# Altium project Earendel_Rules_Enabled_V2.PrjPcb
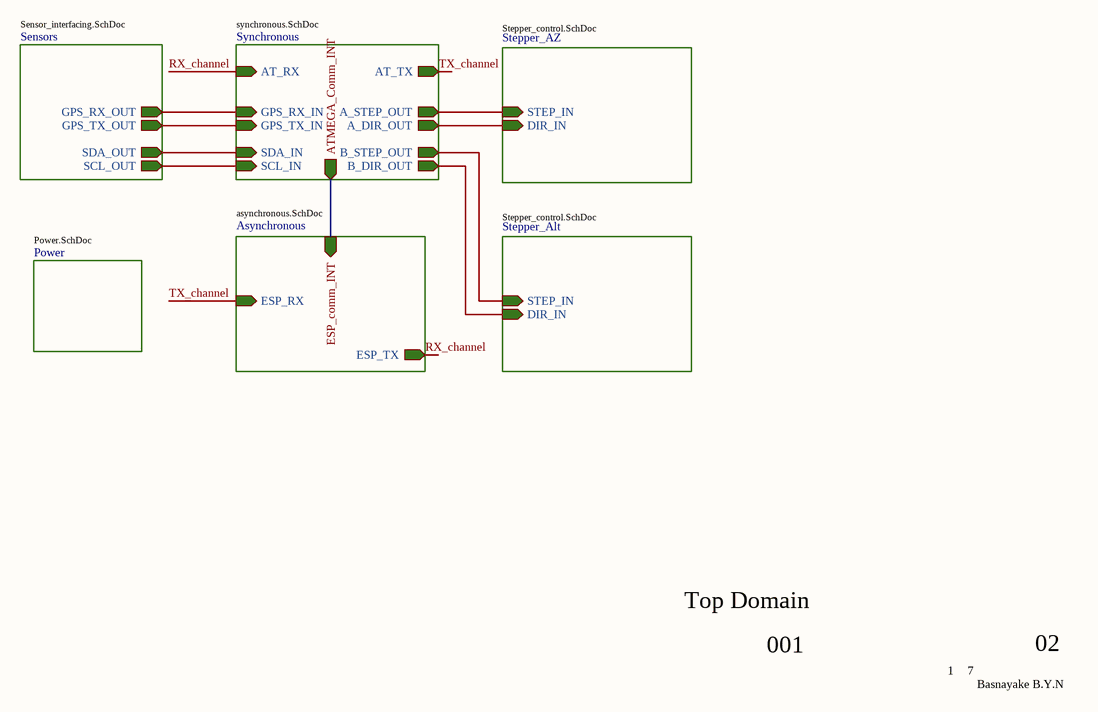
[diagram p0: Top_domain.SchDoc]
6 sheets, 91 parts. Net scope: hierarchical (ports join the sheet entries above them; power ports are global).
Board file: PCBmain.PcbDoc
Sheets:
  Top_domain.SchDoc
    Power = Power.SchDoc
    Synchronous = synchronous.SchDoc
    Asynchronous = asynchronous.SchDoc
    Sensors = Sensor_interfacing.SchDoc
    Stepper_AZ = Stepper_control.SchDoc
    Stepper_Alt = Stepper_control.SchDoc

## Sheet Top_domain.SchDoc
size A4; SheetNumber: 1; SheetTotal: 6

### Sub-sheets
Asynchronous = asynchronous.SchDoc: ESP_RX (in), ESP_TX (out), ESP_comm_INT (in)
Power = Power.SchDoc: no entries
Sensors = Sensor_interfacing.SchDoc: GPS_RX_OUT (out), GPS_TX_OUT (out), SDA_OUT (out), SCL_OUT (out)
Stepper_Alt = Stepper_control.SchDoc: STEP_IN (in), DIR_IN (in)
Stepper_AZ = Stepper_control.SchDoc: STEP_IN (in), DIR_IN (in)
Synchronous = synchronous.SchDoc: AT_TX (out), AT_RX (in), GPS_RX_IN (in), GPS_TX_IN (in), SDA_IN (in), SCL_IN (in), A_STEP_OUT (out), B_STEP_OUT (out), A_DIR_OUT (out), B_DIR_OUT (out), ATMEGA_Comm_INT (out)

### Nets
6P: sheet Synchronous/GPS_RX_IN, sheet Sensors/GPS_RX_OUT
7P: sheet Synchronous/GPS_TX_IN, sheet Sensors/GPS_TX_OUT
45P: sheet Synchronous/B_DIR_OUT, sheet Stepper_Alt/DIR_IN
46P: sheet Synchronous/A_DIR_OUT, sheet Stepper_AZ/DIR_IN
47P: sheet Synchronous/B_STEP_OUT, sheet Stepper_Alt/STEP_IN
48P: sheet Synchronous/A_STEP_OUT, sheet Stepper_AZ/STEP_IN
RX_channel: sheet Synchronous/AT_RX, sheet Asynchronous/ESP_TX  [project net 0P]
SCL: sheet Synchronous/SCL_IN, sheet Sensors/SCL_OUT
SDA: sheet Synchronous/SDA_IN, sheet Sensors/SDA_OUT
TX_channel: sheet Synchronous/AT_TX, sheet Asynchronous/ESP_RX  [project net 1P]
NetU1_4: sheet Synchronous/ATMEGA_Comm_INT, sheet Asynchronous/ESP_comm_INT

### Notes on the sheet
- Top Domain
- 001
- 1
- 7
- 02
- Basnayake B.Y.N

## Sheet Power.SchDoc
size A4; SheetNumber: 4; SheetTotal: 6
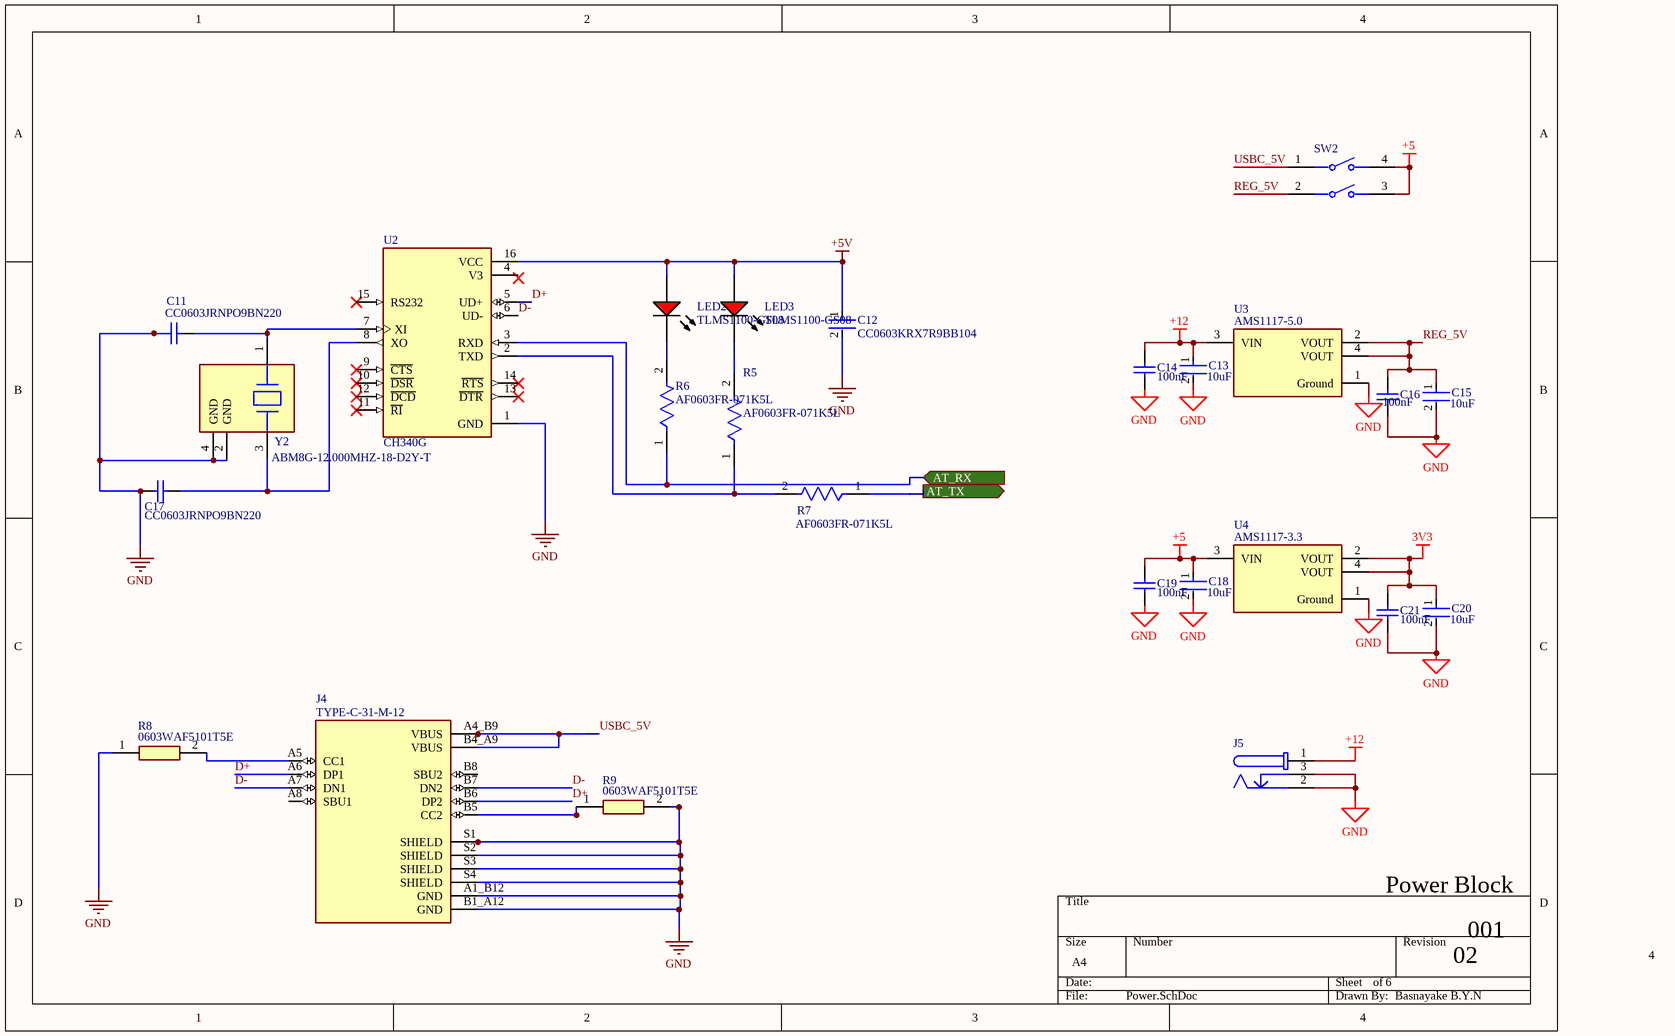
[diagram p1: Power.SchDoc]

### Parts
C11  CC0603JRNPO9BN220  [CAPC1608X90X40LL10T20]
C12  CC0603KRX7R9BB104  [FP-CC0603-DA-MFG]
C13  Capacitance: 10uF  [FP-1206-L_3_2_0_2-W_1_6_0-IPC_B]  (hidden comment: 1206YD106KAT2A)
C14  value 100nF  [CAPC2013X140X50LL20T25]  (hidden comment: 08055F104KAT2A)
C15  Capacitance: 10uF  [FP-1206-L_3_2_0_2-W_1_6_0-IPC_B]  (hidden comment: 1206YD106KAT2A)
C16  value 100nF  [CAPC2013X140X50LL20T25]  (hidden comment: 08055F104KAT2A)
C17  CC0603JRNPO9BN220  [CAPC1608X90X40LL10T20]
C18  Capacitance: 10uF  [FP-1206-L_3_2_0_2-W_1_6_0-IPC_B]  (hidden comment: 1206YD106KAT2A)
C19  value 100nF  [CAPC2013X140X50LL20T25]  (hidden comment: 08055F104KAT2A)
C20  Capacitance: 10uF  [FP-1206-L_3_2_0_2-W_1_6_0-IPC_B]  (hidden comment: 1206YD106KAT2A)
C21  value 100nF  [CAPC2013X140X50LL20T25]  (hidden comment: 08055F104KAT2A)
J4  TYPE-C-31-M-12  [HRO_TYPE-C-31-M-12]
J5  694106301002  [694106301002]  (value not drawn)
LED2  TLMS1100-GS08  [VISH-TLMX1100_V]
LED3  TLMS1100-GS08  [VISH-TLMX1100_V]
R5  AF0603FR-071K5L  [FP-AF0603-IPC_B]
R6  AF0603FR-071K5L  [FP-AF0603-IPC_B]
R7  AF0603FR-071K5L  [FP-AF0603-IPC_B]
R8  0603WAF5101T5E  [RESC1608X55N]
R9  0603WAF5101T5E  [RESC1608X55N]
SW2  A6T-2104  [FP-A6T-2104-MFG]  (value not drawn)
U2  CH340G  [SOIC127P600X180-16N]
U3  AMS1117-5.0  [FP-AMS1117-IPC_C]
U4  AMS1117-3.3  [FP-AMS1117-IPC_C]
Y2  ABM8G-12.000MHZ-18-D2Y-T  [FP-ABM8G-MFG]

### Ports
AT_RX (in), AT_TX (out)

### Nets
3V3: C20.1 C21.2 U4.2(VOUT) U4.4(VOUT)
+5: C18.1 C19.2 SW2.3 SW2.4 U4.3(VIN)
+5V: C12.1 LED2.1(A) LED3.1(A) U2.16(VCC)
+12: C13.1 C14.2 J5.1 U3.3(VIN)
GND: C11.1 C12.2 C13.2 C14.1 C15.2 C16.1 C17.1 C18.2 C19.1 C20.2 C21.1 J4.A1_B12(GND) J4.B1_A12(GND) J4.S1(SHIELD) J4.S2(SHIELD) J4.S3(SHIELD) J4.S4(SHIELD) J5.2 J5.3 R8.1 R9.2 U2.1(GND) U3.1(Ground) U4.1(Ground) Y2.2(GND) Y2.4(GND)
D+: J4.A6(DP1) J4.B6(DP2) U2.5(UD+)
D-: J4.A7(DN1) J4.B7(DN2) U2.6(UD-)
REG_5V: C15.1 C16.2 SW2.2 U3.2(VOUT) U3.4(VOUT)
USBC_5V: J4.A4_B9(VBUS) J4.B4_A9(VBUS) SW2.1
NetC11_2: C11.2 U2.7(XI) Y2.1
NetC17_2: C17.2 U2.8(XO) Y2.3
NetJ4_A5: J4.A5(CC1) R8.2
NetJ4_B5: J4.B5(CC2) R9.1
NetLED2_2: LED2.2(K) R6.2
NetLED3_2: LED3.2(K) R5.2
NetR5_1: R5.1 R7.2 U2.2(TXD)
NetR6_1: R6.1 U2.3(RXD) ; port AT_RX
NetR7_1: R7.1 ; port AT_TX

Not connected (* = marked no-connect by the designer): J4 A8(SBU1) B8(SBU2); U2 4(V3) 9(~{CTS})* 10(~{DSR})* 11(~{RI})* 12(~{DCD})* 13(~{DTR})* 14(~{RTS})* 15(RS232)*

### Notes on the sheet
- Power Block
- 6
- 02
- 001
- 4
- Basnayake B.Y.N

### Library data of the parts
C11 C17 = CMP-1659-00026-1: Chip Capacitor, 22 pF, +/- 5%, 50 V, -55 to 125 degC, 0603 (1608 Metric), RoHS, Tape and Reel; ComponentLink1URL: http://www.yageo.com/; PackageReference: 0603; ComponentLink1Description: Manufacturer URL; PackageDescription: 2-Pin Surface Mount Device, Body 1.6 x 0.8 mm; DatasheetVersion: Rev. 8, 08/2011; ComponentLink2Description: Datasheet; ComponentLink2URL: http://www.yageo.com/documents/recent/UPY-GP_NP0_16V-to-50V_8.pdf
C12 = CMP-2100-03601-2: CAP CER 0.1UF 50V X7R 0603; Manufacturer: YAGEO; Material: Ceramic; Capacitance: 100 nF; Temperature Coefficient: 15%; Tolerance: 0.1; Value: 100 nF; Height: 0.9mm; Voltage: 50 V; ComponentLink2Description: Datasheet; Device Class L2: Capacitors; Temperature Range High: +125°C; Category: Cap; Footprint Url: http://www.yageo.com/exep/pages/download/literatures/UPY-C_GEN_24.pdf; ComponentLink2URL: http://www.yageo.com/documents/recent/UPY-GPHC_X7R_6.3V-to-50V_18.pdf; Package: CC0603-DA; Temperature: -55°C to +125°C; Voltage Rating: 50 V; Temperature Characteristic: X7R; Device Class L1: Passive Components; Temperature Range Low: -55°C; Manufacturer Part Number: CC0603KRX7R9BB104; RoHS: TRUE; Automotive: No; Device Class L3: Ceramic Capacitors; Octopart: https://octopart.com/cc0603krx7r9bb104-yageo-42244635; Mouser Description: Multilayer Ceramic Capacitor, CC Series, 0.1 - F, - 10%, X7R, 50 V, 0603 [1608 Metric]; Lead Free: Yes; Digikey Description: CAP CER 0.1UF 50V X7R 0603
C13 C15 C18 C20 = CMP-04427-000082-1: General Purpose Ceramic Capacitor, 1206, 10uF, 10%, X5R, 15%, 16V; Max Operating Temperature: 85°C; Tolerance: 10%; Dielectric: X5R; Series: -; Case Code (Imperial): 1206; Width: 1.6mm; Termination: SMD/SMT; Voltage Rating: 16V; REACH SVHC: No SVHC; Length: 3.2mm; Size: 1.78mm; Package Quantity: 1; Voltage: 16V; RoHS Compliant: Yes; Thickness: 0.07inch; Mount: Surface Mount; Radiation Hardening: No; Voltage Rating (DC): 16V; Min Operating Temperature: -55°C; Case Code (Metric): 3216; Construction: Flat; Depth: 1.6mm; Height: 0.07mm; Lead Free: Lead Free; Number of Pins: 2; Case/Package: 1206; Packaging: Tape and Reel
C14 C16 C19 C21 = CMP-2007-04784-1: Manufacturer: AVX Interconnect / Elco; Part Number: 08055F104KAT2A
J4 = CMP-004-000000-1: USB Connectors 24 Receptacle 1 8.94*7.3mm RoHS; MF: HRO Electronics Co., Ltd.; SnapEDA_Link: https://www.snapeda.com/parts/TYPE-C-31-M-12/HRO+Electronics+Co.%252C+Ltd./view-part/?ref=snap; Pin Count: 16; Source: TYPE-C-31-M-12.SchLib; Value: *; Component Type: Standard; Availability: Not in stock; Price: None; Package: Package; Design Item ID: TYPE-C-31-M-12; MP: TYPE-C-31-M-12; Check_prices: https://www.snapeda.com/parts/TYPE-C-31-M-12/HRO+Electronics+Co.%252C+Ltd./view-part/?ref=eda
J5 = CMP-1502-00188-2: NexarPartId: 52676100; Voltage Rating (DC): 20V; Gender: Male; Voltage Rating: 24V; Connector Type: Power; Insulation Resistance: 100MΩ; Current Rating: 5A; Shielding: Unshielded; Number of Contacts: 3; Color: Black; Housing Material: Polyamide; Contact Gender: Female; REACH SVHC: Unknown; Termination: Through Hole; Height: 11mm; RoHS: Compliant; Mount: Through Hole; Flammability Rating: UL94 V-0; Packaging: Bulk; Min Operating Temperature: -40°C; Contact Plating: Tin; Max Operating Temperature: 85°C; Operating Supply Voltage: 24V; Contact Material: Gold, Tin
LED2 LED3 = CMP-1666-00027-1: LED, RED, 2.1 V, -40 to 100 degC, 2-Pin SMD (0603), RoHS, Tape and Reel; Type (Capacitors): C0G; Resistance: 100000000000 Ohm; Capacitance: 12 pF; Voltage Rating: 50 V; Tolerance: 5%; Min Operating Temperature: -55degC; REACH SVHC: No SVHC; ComponentLink2Description: Datasheet; ComponentLink1URL: http://www.vishay.com/; Width: 0.8 mm; Package Quantity: 4000; PackageReference: TLMX1100; ComponentLink2URL: http://www.vishay.com/docs/83173/tlmb1100.pdf; Case/Package: 0603; Case Code (Metric): 1608; Packaging: Tape and Reel; Pins: 2; ComponentLink1Description: Manufacturer URL; Max Operating Temperature: 125degC; Height: 0.8 mm; Length: 1.6 mm; Mount: Surface Mount; PackageDescription: 2-Pin Surface Mount Device, Body 1.6 x 0.8 mm; DatasheetVersion: Rev. 2.7, 03/2016; Case Code (Imperial): 0603; Voltage Rating (DC): 50 V; RoHSCompliant: True; Radiation Hardening: No
R5-R7 = CMP-03412-043191-1: Anti-Sulfurated Chip Resistors Automotive Grade 1.5kΩ 1% 100ppm/°C 0603; Resistance: 1.5kR; Max Power Dissipation: 100mW; Length: 0.063inch; Packaging: Tape and Reel; Tolerance: 1%; RoHS Compliant: Yes; Series: AF; Temperature Coefficient: 100ppm/°C; Case/Package: 0603; Height: 0.022inch; Min Operating Temperature: -55°C; Resistor Type: Thick Film; Features: Moisture Resistant; Width: 0.031inch; Number of Terminations: 2; Max Operating Temperature: 155°C
R8 R9 = 0603WAF5101T5E: Resistor; Manufacturer_Name: UNI-ROYAL(Uniroyal Elec); Datasheet Link: https://datasheet.lcsc.com/szlcsc/Uniroyal-Elec-0603WAF5101T5E_C23186.pdf; Height: 0.55mm; Manufacturer_Part_Number: 0603WAF5101T5E
SW2 = CMP-08827-000029-1: SWITCH SLIDE DIP SPST 25MA 24V; Pitch: 0.1inch; Contact Resistance: 200mR; Electrical Life: 1000Cycles; Number of Circuits: 2; Washable: No; Actuator Length: 0.6mm; Actuator Type: Slide (Standard); Max Current Rating: 25mA; Termination: PC Pins; Mount: Through Hole; Max Operating Temperature: 70°C; Throw Configuration: SPST; Packaging: Rail/Tube; Contact Current Rating: 25mA; Current Rating: 25mA; Case/Package: DIP; Width: 6.2mm; Radiation Hardening: No; Lead Free: Lead Free; Series: A6T; Package Quantity: 76; Voltage Rating (DC): 24V; Min Operating Temperature: -20°C; Contact Plating: Gold; Number of Positions: 2; Orientation: Straight; RoHS Compliant: Yes; Terminal Pitch: 2.54mm; Weight: 0.26g; Length: 0.237inch; Max Voltage Rating (DC): 24V; Mechanical Life: 1000Cycles; Height: 4.2mm; Contact Material: Gold
U2 = CMP-002-000000-1: USB Interface Integrated Circuit; MF: WCH; Package: None; Check_prices: https://www.snapeda.com/parts/Ch340G/WCH/view-part/?ref=eda; Value: *; Pin Count: 16; Design Item ID: CH340G; MP: Ch340G; Price: None; SnapEDA_Link: https://www.snapeda.com/parts/Ch340G/WCH/view-part/?ref=snap; Availability: Not in stock; Component Type: Standard; Source: CH340G.SchLib
U3 = CMP-209535-000001-1: LDO Voltage Regulators 1A, 3.3V; Manufacturer Part Number: AMS1117-3.3; Manufacturer: Advanced Monolithic Systems; Dropout Voltage: 1.1V; Output Type: Fixed; Nominal Supply Current: 5mA; Max Power Dissipation: 1.2W; Max Supply Voltage: 15V; Number Of Outputs: 1; Standoff Height: 0.64mm; Max Junction Temp: +125°C; Height: 1.8mm; Package: AMS1117; Device Class L2: Power Management ICs; ComponentLink2Description: Datasheet; ComponentLink2URL: http://www.advanced-monolithic.com/pdf/ds1117.pdf; Category: IC; RoHS: TRUE; Automotive: No; Device Class L1: Integrated Circuits (ICs); Output Current: 1A; Device Class L3: Voltage Regulators - Linear; Temperature: -40°C to +125°C; Output Voltage: 3.3V; Temperature Range Low: -40°C; Octopart: https://octopart.com/ams1117-3.3-advanced+monolithic+systems-25899300; Lead Free: Yes; Ipc Land Pattern Name: SOT229P700X180-4; Temperature Range High: +125°C
U4 = CMP-209535-000001-1: LDO Voltage Regulators 1A, 3.3V; Manufacturer: Advanced Monolithic Systems; Dropout Voltage: 1.1V; Output Type: Fixed; Nominal Supply Current: 5mA; Max Power Dissipation: 1.2W; Max Supply Voltage: 15V; Number Of Outputs: 1; Standoff Height: 0.64mm; Max Junction Temp: +125°C; Height: 1.8mm; Package: AMS1117; Device Class L2: Power Management ICs; ComponentLink2Description: Datasheet; ComponentLink2URL: http://www.advanced-monolithic.com/pdf/ds1117.pdf; Category: IC; RoHS: TRUE; Automotive: No; Device Class L1: Integrated Circuits (ICs); Output Current: 1A; Device Class L3: Voltage Regulators - Linear; Temperature: -40°C to +125°C; Output Voltage: 3.3V; Manufacturer Part Number: AMS1117-3.3; Temperature Range Low: -40°C; Octopart: https://octopart.com/ams1117-3.3-advanced+monolithic+systems-25899300; Lead Free: Yes; Ipc Land Pattern Name: SOT229P700X180-4; Temperature Range High: +125°C
Y2 = CMP-2000-05039-3: Crystal 12MHz ±20ppm (Tol) ±30ppm (Stability) 18pF FUND 120Ω 4-Pin SMD T/R; Series Resistance: 120R; Max Operating Temperature: 85°C; Mount: Surface Mount; Width: 2.5mm; Series: ABM8G; Termination: SMD/SMT; Frequency Tolerance: 20ppm; Tolerance: 20ppm; Min Operating Temperature: -40°C; Operating Frequency: 12 MHz; Depth: 2.5mm; Load Capacitance: 18pF; Number of Pins: 4; Length: 3.2mm; Radiation Hardening: No; Frequency Stability: 30ppm; Height: 1mm; Packaging: Tape and Reel; Package Quantity: 1000; ESR (Equivalent Series Resistance): 120R; Lead Free: Lead Free; Frequency: 12MHz; Case/Package: CSMD

## Sheet synchronous.SchDoc
size A4; SheetNumber: 3; SheetTotal: 6
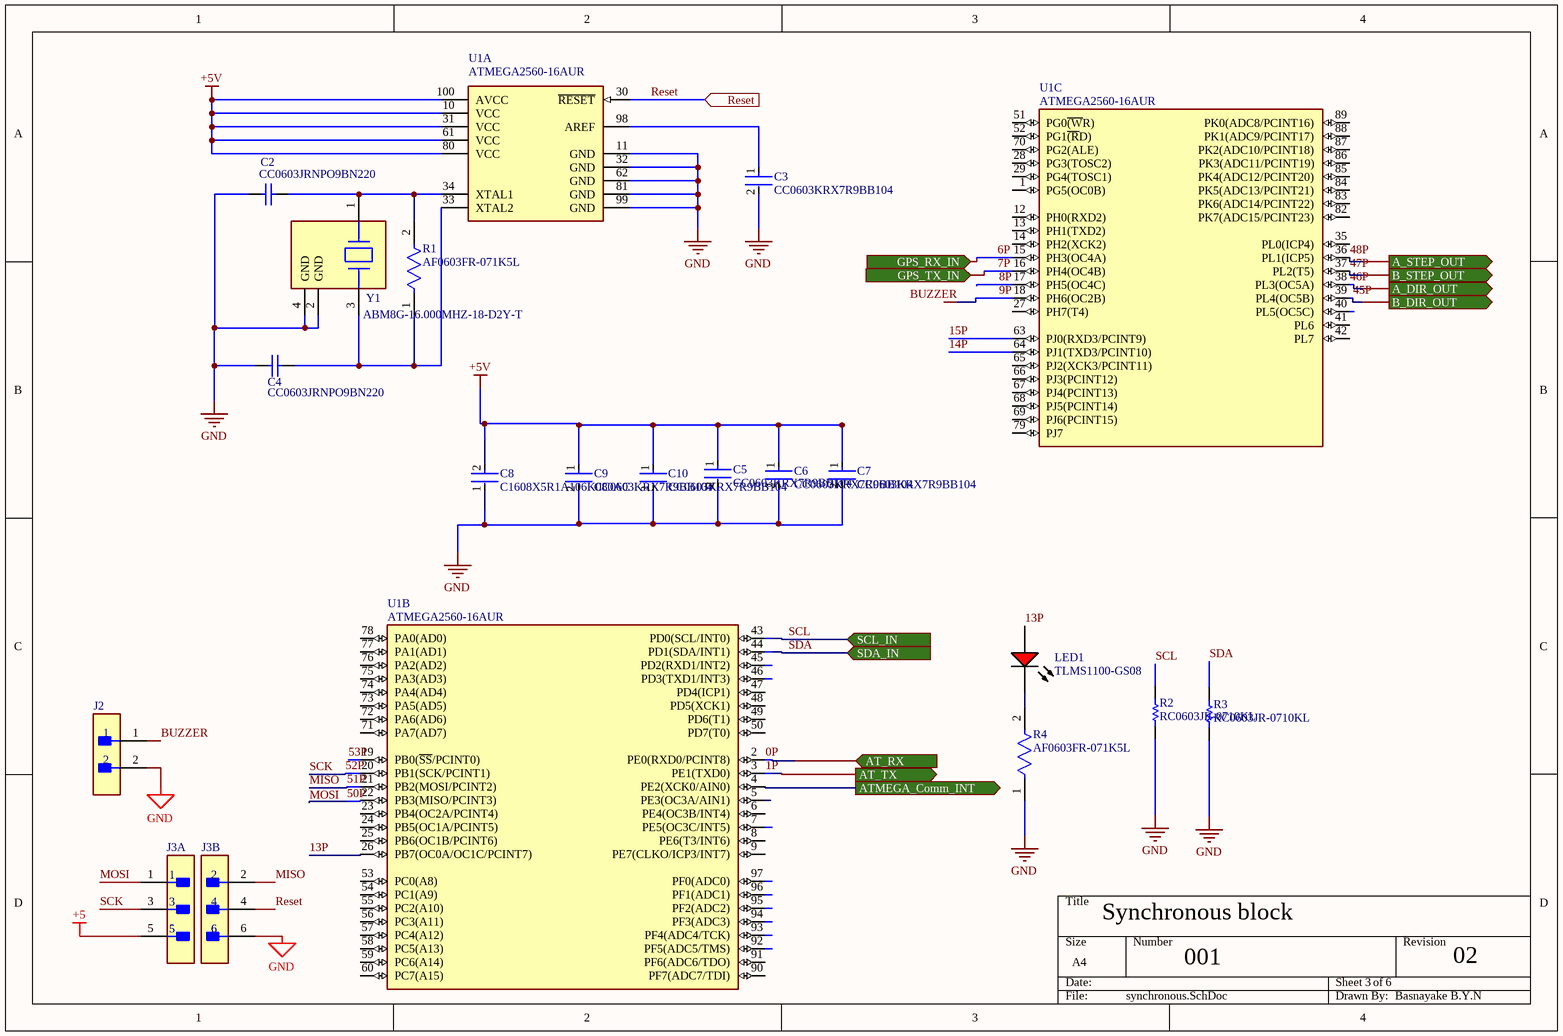
[diagram p2: synchronous.SchDoc]

### Parts
C2  CC0603JRNPO9BN220  [CAPC1608X90X40LL10T20]
C3  CC0603KRX7R9BB104  [FP-CC0603-DA-MFG]
C4  CC0603JRNPO9BN220  [CAPC1608X90X40LL10T20]
C5  CC0603KRX7R9BB104  [FP-CC0603-DA-MFG]
C6  CC0603KRX7R9BB104  [FP-CC0603-DA-MFG]
C7  CC0603KRX7R9BB104  [FP-CC0603-DA-MFG]
C8  C1608X5R1A106K080AC  [FP-C1608-080-0_1-MFG]
C9  CC0603KRX7R9BB104  [FP-CC0603-DA-MFG]
C10  CC0603KRX7R9BB104  [FP-CC0603-DA-MFG]
J2  B2B-XH-A(LF)(SN)  [FP-B2B-XH-A_LF_SN-MFG]  (value not drawn)
J3  M20-9980346  [FP-M20-9980346-MFG]  (value not drawn)  (parts A,B of 2)
LED1  TLMS1100-GS08  [VISH-TLMX1100_V]
R1  AF0603FR-071K5L  [FP-AF0603-IPC_B]
R2  RC0603JR-0710KL  [RESC1608X55X25ML10T15]
R3  RC0603JR-0710KL  [RESC1608X55X25ML10T15]
R4  AF0603FR-071K5L  [FP-AF0603-IPC_B]
U1  ATMEGA2560-16AUR  [FP-100A-MFG]  (parts A,B,C of 3)
Y1  ABM8G-16.000MHZ-18-D2Y-T  [FP-ABM8G-MFG]

### Ports
A_DIR_OUT (out, see Top_domain[3B]), A_STEP_OUT (out, see Top_domain[3B]), AT_RX (in, see Top_domain[2B]), AT_TX (out, see Top_domain[3B]), ATMEGA_Comm_INT (out, see Top_domain[2B]), B_DIR_OUT (out, see Top_domain[3B]), B_STEP_OUT (out, see Top_domain[3B]), GPS_RX_IN (in, see Top_domain[2B]), GPS_TX_IN (in, see Top_domain[2B]), Reset (in), SCL_IN (in, see Top_domain[2B]), SDA_IN (in, see Top_domain[2B])

### Nets
+5: J3.5
+5V: C5.1 C6.1 C7.1 C8.2 C9.1 C10.1 U1.10(VCC) U1.31(VCC) U1.61(VCC) U1.80(VCC) U1.100(AVCC)
GND: C2.1 C3.2 C4.1 C5.2 C6.2 C7.2 C8.1 C9.2 C10.2 J2.2 J3.6 R2.1 R3.1 R4.1 U1.11(GND) U1.32(GND) U1.62(GND) U1.81(GND) U1.99(GND) Y1.2(GND) Y1.4(GND)
0P: U1.2(PE0(RXD0/PCINT8)) ; port AT_RX
1P: U1.3(PE1(TXD0)) ; port AT_TX
6P: U1.15(PH3(OC4A)) ; port GPS_RX_IN
7P: U1.16(PH4(OC4B)) ; port GPS_TX_IN
8P: U1.17(PH5(OC4C))
9P: U1.18(PH6(OC2B))
13P: LED1.1(A) U1.26(PB7(OC0A/OC1C/PCINT7))
14P: U1.64(PJ1(TXD3/PCINT10))
15P: U1.63(PJ0(RXD3/PCINT9))
45P: U1.39(PL4(OC5B)) ; port B_DIR_OUT
46P: U1.38(PL3(OC5A)) ; port A_DIR_OUT
47P: U1.37(PL2(T5)) ; port B_STEP_OUT
48P: U1.36(PL1(ICP5)) ; port A_STEP_OUT
50P: J3.1 U1.22(PB3(MISO/PCINT3))  [also labelled MOSI]
51P: J3.2 U1.21(PB2(MOSI/PCINT2))  [also labelled MISO]
52P: J3.3 U1.20(PB1(SCK/PCINT1))  [also labelled SCK]
53P: U1.19(PB0(~{SS}/PCINT0))
BUZZER: J2.1
Reset: J3.4 U1.30(~{RESET}) ; port Reset
SCL: R2.2 U1.43(PD0(SCL/INT0)) ; port SCL_IN
SDA: R3.2 U1.44(PD1(SDA/INT1)) ; port SDA_IN
NetC2_2: C2.2 R1.2 U1.34(XTAL1) Y1.1
NetC3_1: C3.1 U1.98(AREF)
NetC4_2: C4.2 R1.1 U1.33(XTAL2) Y1.3
NetLED1_2: LED1.2(K) R4.2
NetU1_4: U1.4(PE2(XCK0/AIN0)) ; port ATMEGA_Comm_INT

Not connected (* = marked no-connect by the designer): U1 1(PG5(OC0B)) 5(PE3(OC3A/AIN1)) 6(PE4(OC3B/INT4)) 7(PE5(OC3C/INT5)) 8(PE6(T3/INT6)) 9(PE7(CLKO/ICP3/INT7)) 12(PH0(RXD2)) 13(PH1(TXD2)) 14(PH2(XCK2)) 23(PB4(OC2A/PCINT4)) 24(PB5(OC1A/PCINT5)) 25(PB6(OC1B/PCINT6)) 27(PH7(T4)) 28(PG3(TOSC2)) 29(PG4(TOSC1)) 35(PL0(ICP4)) 40(PL5(OC5C)) 41(PL6) 42(PL7) 45(PD2(RXD1/INT2)) 46(PD3(TXD1/INT3)) 47(PD4(ICP1)) 48(PD5(XCK1)) 49(PD6(T1)) 50(PD7(T0)) 51(PG0~{(W}R)) 52(PG1~{(R}D)) 53(PC0(A8)) 54(PC1(A9)) 55(PC2(A10)) 56(PC3(A11)) 57(PC4(A12)) 58(PC5(A13)) 59(PC6(A14)) 60(PC7(A15)) 65(PJ2(XCK3/PCINT11)) 66(PJ3(PCINT12)) 67(PJ4(PCINT13)) 68(PJ5(PCINT14)) 69(PJ6(PCINT15)) 70(PG2(ALE)) 71(PA7(AD7)) 72(PA6(AD6)) 73(PA5(AD5)) 74(PA4(AD4)) 75(PA3(AD3)) 76(PA2(AD2)) 77(PA1(AD1)) 78(PA0(AD0)) 79(PJ7) 82(PK7(ADC15/PCINT23)) 83(PK6(ADC14/PCINT22)) 84(PK5(ADC13/PCINT21)) 85(PK4(ADC12/PCINT20)) 86(PK3(ADC11/PCINT19)) 87(PK2(ADC10/PCINT18)) 88(PK1(ADC9/PCINT17)) 89(PK0(ADC8/PCINT16)) 90(PF7(ADC7/TDI)) 91(PF6(ADC6/TDO)) 92(PF5(ADC5/TMS)) 93(PF4(ADC4/TCK)) 94(PF3(ADC3)) 95(PF2(ADC2)) 96(PF1(ADC1)) 97(PF0(ADC0))

### Notes on the sheet
- Synchronous block
- 001
- 3
- 6
- 02
- Basnayake B.Y.N
- Labels drawn without touching a wire or pin: BUZZER

### Library data of the parts
C2 C4 = CMP-1659-00026-1: as C11 on sheet Power; ComponentLink1URL: http://www.yageo.com/; PackageReference: 0603; ComponentLink1Description: Manufacturer URL; PackageDescription: 2-Pin Surface Mount Device, Body 1.6 x 0.8 mm; DatasheetVersion: Rev. 8, 08/2011; ComponentLink2Description: Datasheet; ComponentLink2URL: http://www.yageo.com/documents/recent/UPY-GP_NP0_16V-to-50V_8.pdf
C3 C5-C7 C9 C10 = CMP-2100-03601-2: as C12 on sheet Power; Height: 0.9mm; Voltage: 50 V; ComponentLink2Description: Datasheet; Device Class L2: Capacitors; Temperature Range High: +125°C; Category: Cap; Footprint Url: http://www.yageo.com/exep/pages/download/literatures/UPY-C_GEN_24.pdf; ComponentLink2URL: http://www.yageo.com/documents/recent/UPY-GPHC_X7R_6.3V-to-50V_18.pdf; Package: CC0603-DA; Temperature: -55°C to +125°C; Voltage Rating: 50 V; Temperature Characteristic: X7R; Device Class L1: Passive Components; Temperature Range Low: -55°C; Manufacturer Part Number: CC0603KRX7R9BB104; RoHS: TRUE; Automotive: No; Device Class L3: Ceramic Capacitors; Octopart: https://octopart.com/cc0603krx7r9bb104-yageo-42244635; Mouser Description: Multilayer Ceramic Capacitor, CC Series, 0.1 - F, - 10%, X7R, 50 V, 0603 [1608 Metric]; Lead Free: Yes; Digikey Description: CAP CER 0.1UF 50V X7R 0603
C8 = CMP-2000-04979-3: Multilayer Ceramic Capacitors 10μF ±10% 10V X5R SMD 0603; Capacitance: 10uF; Dielectric Material: Ceramic; Construction: Flat; Height: 0.8mm; Thickness: 0.035inch; Case Code (Metric): 1608; Radiation Hardening: No; Number of Pins: 2; Voltage Rating (DC): 10V; Depth: 0.8mm; Voltage: 10V; RoHS Compliant: Yes; Voltage Rating: 10V; Package Quantity: 1; Resistor Type: Ceramic; Termination: SMD/SMT; Lead Free: Lead Free; REACH SVHC: No SVHC; Tolerance: 10%; Mount: Surface Mount; Series: C; Packaging: Tape and Reel; Width: 0.8mm; Dielectric: X5R; Weight: 7.1E-05oz; Length: 1.6mm; Max Operating Temperature: 85°C; Case Code (Imperial): 0603; Case/Package: 0603; Min Operating Temperature: -55°C
J2 = CMP-2000-05888-3: CONN HEADER VERT 2POS 2.5MM; Current Rating: 3A; Voltage Rating: 250V; Number of Contacts: 2; Contact Resistance: 20mR; Wire/Cable Gauge: 22AWG; Insulation Resistance: 1GR; Connector Type: Male Pin; Packaging: Bulk; Contact Material: Brass; Lead Free: Lead Free; Orientation: Straight; Contact Plating: Tin; Max Current Rating: 3A; Termination: Solder; Fastening Type: Detent; Depth: 5.75mm; Housing Material: Polyamide; REACH SVHC: No SVHC; Series: XH; Voltage Rating (AC): 250V; Number of Positions: 2; Color: Natural; Contact Type: Male Pin; Max Voltage Rating (DC): 250V; Pitch: 2.5mm; Lead Pitch: 2.5mm; Mount: Through Hole; Max Operating Temperature: 85°C; Length: 7.4mm; Max Voltage Rating (AC): 250V; Min Operating Temperature: -25°C; Number of Rows: 1; Housing Color: White
J3 = CMP-2000-06636-2: CONN HEADER VERT 6POS 2.54MM; Manufacturer: Harwin; Current Rating: 3A; Number Of Contacts: 6; Conn Gender: Male; Conn Orientation: Vertical; Device Class L1: Connectors; ComponentLink2Description: Datasheet; Height: 8.99mm; Temperature Range High: +105°C; Contact Material: Tin,Nickel; RoHS: TRUE; Temperature Range Low: -40°C; ComponentLink2URL: https://cdn.harwin.com/pdfs/M20-998.pdf; Digikey Description: CONN HEADER VERT 6POS 2.54MM; Pitch: 2.54mm; Package: M20-9980346; Device Class L2: Headers and Wire Housings; Manufacturer Part Number: M20-9980346; Number Of Rows: 2; Category: Conn; Lead Free: Yes; Mouser Description: 2.54mm (0.1") Pitch DIL Vertical PC Tail Pin Header, 6.1mm mating pin height, tin, 3+3 contacts; Temperature: -40°C to +105°C; Device Class L3: unset; Octopart: https://octopart.com/m20-9980346-harwin-5436545; Automotive: No
LED1 = CMP-1666-00027-1: as LED2 on sheet Power; Min Operating Temperature: -55degC; REACH SVHC: No SVHC; ComponentLink2Description: Datasheet; ComponentLink1URL: http://www.vishay.com/; Width: 0.8 mm; Package Quantity: 4000; PackageReference: TLMX1100; ComponentLink2URL: http://www.vishay.com/docs/83173/tlmb1100.pdf; Case/Package: 0603; Case Code (Metric): 1608; Packaging: Tape and Reel; Pins: 2; ComponentLink1Description: Manufacturer URL; Max Operating Temperature: 125degC; Height: 0.8 mm; Length: 1.6 mm; Mount: Surface Mount; PackageDescription: 2-Pin Surface Mount Device, Body 1.6 x 0.8 mm; DatasheetVersion: Rev. 2.7, 03/2016; Case Code (Imperial): 0603; Voltage Rating (DC): 50 V; RoHSCompliant: True; Radiation Hardening: No
R1 R4 = CMP-03412-043191-1: as R5 on sheet Power; Length: 0.063inch; Packaging: Tape and Reel; Tolerance: 1%; RoHS Compliant: Yes; Series: AF; Temperature Coefficient: 100ppm/°C; Case/Package: 0603; Height: 0.022inch; Min Operating Temperature: -55°C; Resistor Type: Thick Film; Features: Moisture Resistant; Width: 0.031inch; Number of Terminations: 2; Max Operating Temperature: 155°C
R2 R3 = CMP-2000-05022-1: Resistor, 10 KOhm, +/- 5%, 100 mW, -55 to 155 degC, 0603 (1608 Metric), RoHS, Tape and Reel; Manufacturer: Yageo; Resistance: 10kOhms; Voltage Rating: 50V; Temperature Coefficient: 100PPM/C; Power Rating: 100mW; Package Reference: 603; Series: RC; Case Code - mm: 1608; Packaging: Reel; Datasheet URL: http://www.farnell.com/datasheets/443971.pdf; Datasheet Version: Rev. 4, 04/2009; Operating Temperature Range: -55Cto+155C; Product: ThickFilmResistorsGeneralPurpose; Package Description: 2-Pin Surface Mount Device, Body 1.6 x 0.8 mm; Manufacturer URL: http://www.yageo.com/; Case Code - in: 0603; Tolerance: 5%; Termination Style: SMD/SMT
U1 = CMP-06276-000073-1: IC MCU 8BIT 256KB FLASH 100TQFP; Oscillator Type: External; Interface: UART; Memory Type: OTP; Memory Size: 8KB; Core Architecture: PIC; Peripherals: POR; Frequency: 16MHz; Number of I/Os: 33; Packaging: Rail/Tube; Max Operating Temperature: 70°C; Case/Package: DIP; Min Operating Temperature: 0°C
Y1 = CMP-2000-05039-3: as Y2 on sheet Power; Max Operating Temperature: 85°C; Mount: Surface Mount; Width: 2.5mm; Series: ABM8G; Termination: SMD/SMT; Frequency Tolerance: 20ppm; Tolerance: 20ppm; Min Operating Temperature: -40°C; Operating Frequency: 12 MHz; Depth: 2.5mm; Load Capacitance: 18pF; Number of Pins: 4; Length: 3.2mm; Radiation Hardening: No; Frequency Stability: 30ppm; Height: 1mm; Packaging: Tape and Reel; Package Quantity: 1000; ESR (Equivalent Series Resistance): 120R; Lead Free: Lead Free; Frequency: 12MHz; Case/Package: CSMD

## Sheet asynchronous.SchDoc
size A4; SheetNumber: 5; SheetTotal: 6
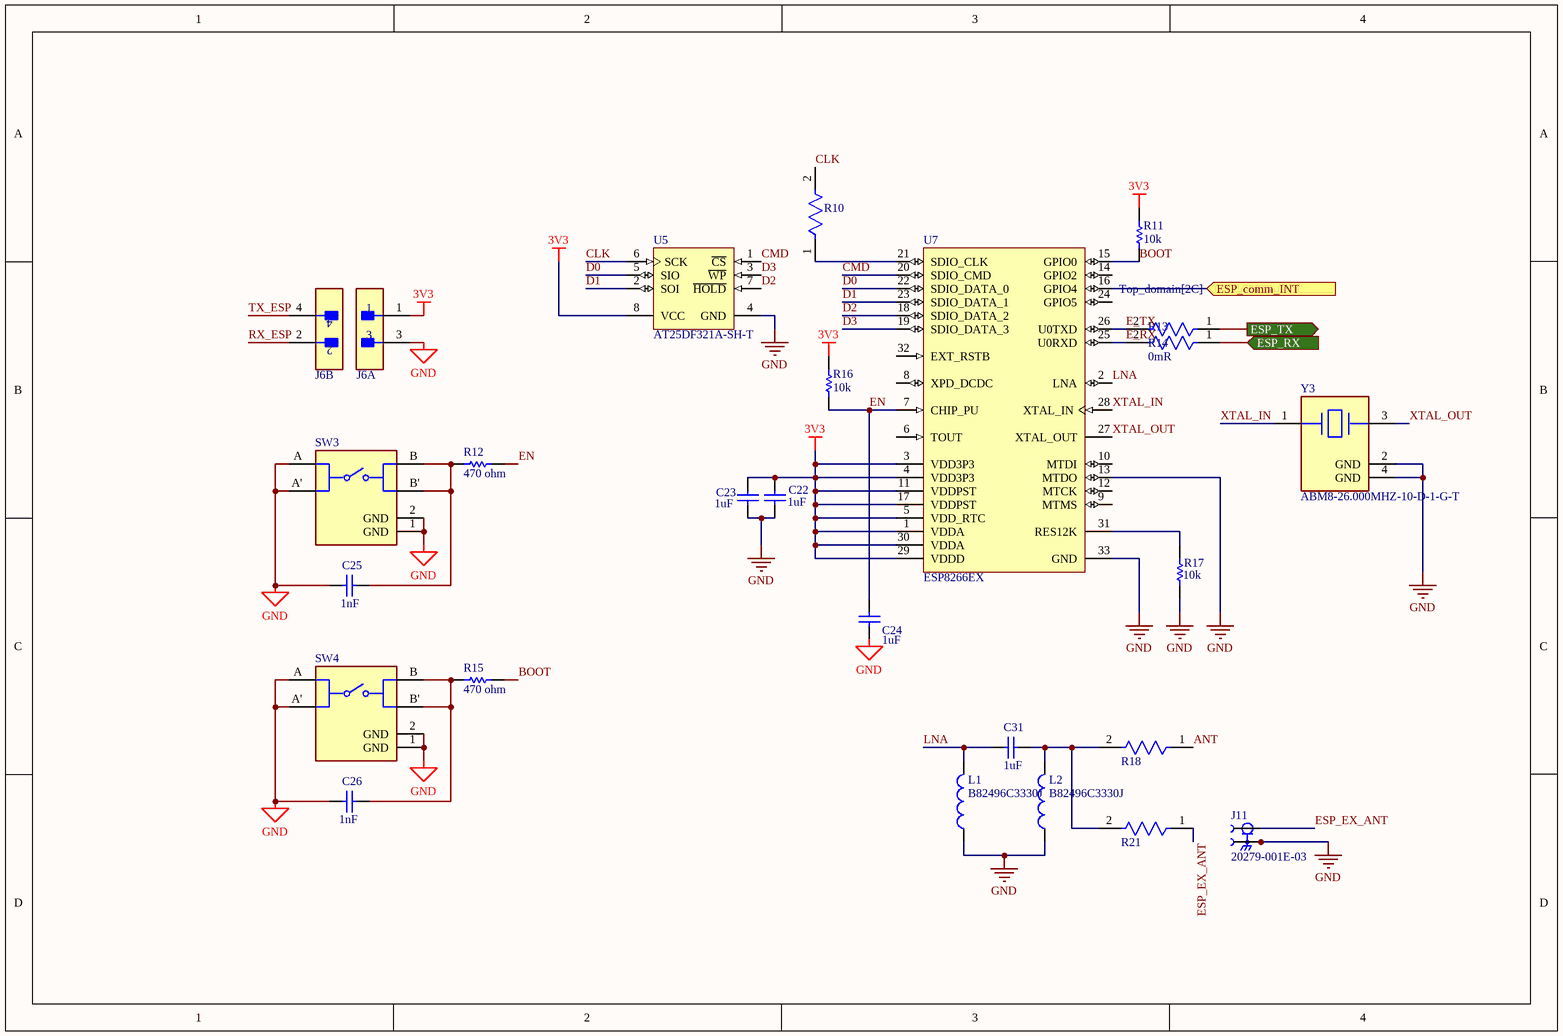
[diagram p3: asynchronous.SchDoc]

### Parts
C22  Parameter 1: 1uF  [CAPC2013X145X50LL20T25]  (hidden comment: C0805C105K4PACTU)
C23  Parameter 1: 1uF  [CAPC2013X145X50LL20T25]  (hidden comment: C0805C105K4PACTU)
C24  Parameter 1: 1uF  [CAPC2013X145X50LL20T25]  (hidden comment: C0805C105K4PACTU)
C25  Parameter 1: 1nF  [CAPC2013X145X48LL20T23]  (hidden comment: VJ0805D102KXAAJ)
C26  Parameter 1: 1nF  [CAPC2013X145X48LL20T23]  (hidden comment: VJ0805D102KXAAJ)
C31  Parameter 1: 1uF  [CAPC2013X145X50LL20T25]  (hidden comment: C0805C105K4PACTU)
J6  PEC02DABN  [FP-PEC02DABN-MFG]  (value not drawn)  (parts A,B of 2)
J11  20279-001E-03  [IPEX_20279-001E-03]
L1  B82496C3330J  [INDC1608X90X30LL10T20]
L2  B82496C3330J  [INDC1608X90X30LL10T20]
R10  CR0805-J/-000ELF  [FP-CR0805-IPC_C]  (value not drawn)
R11  Parameter 1: 10k  [RESC2013X60X35NL10T20]  (hidden comment: RC0805FR-0710KL)
R12  Parameter 1: 470 ohm  [RESC2013X50X30LL20T20]  (hidden comment: CRCW0805470RFKEA)
R13  Resistance: 0mR  [FP-CR0805-IPC_C]  (hidden comment: CR0805-J/-000ELF)
R14  CR0805-J/-000ELF  [FP-CR0805-IPC_C]  (value not drawn)
R15  Parameter 1: 470 ohm  [RESC2013X50X30LL20T20]  (hidden comment: CRCW0805470RFKEA)
R16  Parameter 1: 10k  [RESC2013X60X35NL10T20]  (hidden comment: RC0805FR-0710KL)
R17  Parameter 1: 10k  [RESC2013X60X35NL10T20]  (hidden comment: RC0805FR-0710KL)
R18  CR0805-J/-000ELF  [FP-CR0805-IPC_C]  (value not drawn)
R21  CR0805-J/-000ELF  [FP-CR0805-IPC_C]  (value not drawn)
SW3  EVQ-PLMA15  [FP-EVQ-PLMA15-MFG]  (value not drawn)
SW4  EVQ-PLMA15  [FP-EVQ-PLMA15-MFG]  (value not drawn)
U5  AT25DF321A-SH-T  [ADST-S2-8_N]
U7  ESP8266EX  [ESFS-QFN-32_L]
Y3  ABM8-26.000MHZ-10-D-1-G-T  [FP-ABM8-MFG]

### Ports
ESP_comm_INT (in, see Top_domain[2C]), ESP_RX (in, see Top_domain[2C]), ESP_TX (out, see Top_domain[3C])

### Nets
3V3: C22.2 C23.2 J6.1 R11.1 R16.1 U5.8(VCC) U7.1(VDDA) U7.3(VDD3P3) U7.4(VDD3P3) U7.5(VDD_RTC) U7.11(VDDPST) U7.17(VDDPST) U7.29(VDDD) U7.30(VDDA)
GND: C22.1 C23.1 C24.1 C25.1 C26.1 J6.3 J11.2(GROUND) J11.3(GROUND) L1.1 L2.1 R17.1 SW3.1(GND) SW3.2(GND) SW3.A SW3.A' SW4.1(GND) SW4.2(GND) SW4.A SW4.A' U5.4(GND) U7.13(MTDO) U7.33(GND) Y3.2(GND) Y3.4(GND)
0P: R14.1 ; port ESP_TX
1P: R13.1 ; port ESP_RX
ANT: R18.1
BOOT: R11.2 R15.2 U7.15(GPIO0)
CLK: R10.2 U5.6(SCK)
CMD: U5.1(~{CS}) U7.20(SDIO_CMD)
D0: U5.5(SIO) U7.22(SDIO_DATA_0)
D1: U5.2(SOI) U7.23(SDIO_DATA_1)
D2: U5.7(~{HOLD}) U7.18(SDIO_DATA_2)
D3: U5.3(~{WP}) U7.19(SDIO_DATA_3)
E_RX: R13.2 U7.25(U0RXD)
E_TX: R14.2 U7.26(U0TXD)
EN: C24.2 R12.2 R16.2 U7.7(CHIP_PU)
ESP_EX_ANT: J11.1(SIGNAL) R21.1
LNA: C31.2 L1.2 U7.2(LNA)
RX_ESP: J6.2
TX_ESP: J6.4
XTAL_IN: U7.28(XTAL_IN) Y3.1
XTAL_OUT: U7.27(XTAL_OUT) Y3.3
NetC25_2: C25.2 R12.1 SW3.B SW3.B'
NetC26_2: C26.2 R15.1 SW4.B SW4.B'
NetC31_1: C31.1 L2.2 R18.2 R21.2
NetR10_1: R10.1 U7.21(SDIO_CLK)
NetR17_2: R17.2 U7.31(RES12K)
NetU1_4: U7.16(GPIO4) ; port ESP_comm_INT

Not connected (* = marked no-connect by the designer): U7 6(TOUT) 8(XPD_DCDC) 9(MTMS) 10(MTDI) 12(MTCK) 14(GPIO2) 24(GPIO5) 32(EXT_RSTB)

### Library data of the parts
C22-C24 C31 = CMP-1036-04746-2: Manufacturer: Kemet; Part Number: C0805C105K4PACTU
C25 C26 = CMP-2007-03135-1: Manufacturer: Vitramon; Part Number: VJ0805D102KXAAJ
J6 = CMP-25680-000069-1: CONN HEADER VERT 4POS 2.54MM; Number of Contacts: 4; Row Spacing: 0.1inch; Connector Type: Male Pin; Gender: Male; Series: -; Housing Material: Plastic; Contact Material: Bronze; Length: 5.08mm; RoHS Compliant: Yes; Width: 5.08mm; Min Operating Temperature: -65°C; Contact Shape: Square; Pitch: 0.1inch; Lead Free: Lead Free; Number of Positions: 4; Fastening Type: Pull; Contact Plating: Tin; Flammability Rating: UL94 V-0; Packaging: Bulk; Termination: Solder; Max Operating Temperature: 125°C; Package Quantity: 1; Number of Rows: 2; Contact Mating Length: 0.23inch; Contact Finish - Mating: TIN; Height: 2.54mm; Insulation Color: Black; Mount: Through Hole; Insulation Material: PBT; Color: Black; Housing Color: Black; Contact Type: Male Pin
J11 = 20279-001E-03: 1 POS Vertical SMD Small form factor with big performance through 6 GHz connector,MHF, RF, micro-coaxial MHF I Receptacle; MF: I-PEX; SnapEDA_Link: https://www.snapeda.com/parts/20279-001E-03/I-PEX/view-part/?ref=snap; Package: None; Value: *; MP: 20279-001E-03; Check_prices: https://www.snapeda.com/parts/20279-001E-03/I-PEX/view-part/?ref=eda
L1 L2 = CMP-2000-05913-1: Unshielded Wirewound Inductor, 33 nH, 350 mA, -55 to 150 degC, 0603 (1608 Metric), RoHS, Tape and Reel; Manufacturer: EPCOS-(TDK); Q @ Freq: 14@100MHz; Inductance: 33nH; Material - Core: Ceramic; Frequency - Self Resonant: 3GHz; DC Resistance (DCR): 600mOhmMax; Tolerance: ±5%; Frequency - Test: 100MHz; Current Rating: 350mA; Manufacturer URL: http://www.tdk.com/; Type: Wirewound; Mounting Type: SurfaceMount; Mounting Technology: SurfaceMount; Height - Seated (Max): 0.035"(0.90mm); Datasheet URL: https://en.tdk.eu/inf/30/db/ind_2008/b82496c.pdf; Shielding: Unshielded; Operating Temperature: -; Size / Dimension: 0.063"Lx0.031"W(1.60mmx0.80mm); Series: SIMID; Current - Saturation: -; Ratings: AEC-Q200; Packaging: CutTape(CT); Package Reference: 0603; Datasheet Version: 07/2016; Category: Inductors,Coils,Chokes; Package Description: 2-Pin Surface Mount Device, Body 1.6 x 0.8 mm; Family: FixedInductors; Package / Case: 0603(1608Metric)
R10 R14 R18 R21 = CMP-07231-004348-1: Thick Film Chip Resistors 0805 0Ω 0.125W 5%; Voltage Rating: 150V; Max Power Dissipation: 125mW; Temperature Coefficient: 500ppm/°C; Resistance: 0mR; Min Operating Temperature: -55°C; Case Code (Metric): 2012; Height: 0.5mm; Contact Plating: Tin; Thickness: 508um; Military Standard: Not; Composition: Thick Film; REACH SVHC: No SVHC; Voltage Rating (DC): 150V; Length: 2mm; Radiation Hardening: No; Case/Package: 0805; Package Quantity: 5000; Number of Pins: 2; Max Operating Temperature: 155°C; Case Code (Imperial): 0805; Mount: Surface Mount; Depth: 1.25mm; Packaging: Tape and Reel; Tolerance: 5%; Termination: SMD/SMT; Width: 1.25mm; Power Rating: 125mW
R11 R16 R17 = CMP-1659-00013-4: Chip Resistor, 10 KOhm, +/- 1%, 0.125 W, -55 to 155 degC, 0805 (2012 Metric), RoHS, Tape and Reel; Manufacturer: Yageo; Voltage Rating: 150 V; Mount: Surface Mount; ComponentLink1Description: Manufacturer URL; ComponentLink2URL: http://www.yageo.com/documents/recent/PYu-RC_Group_51_RoHS_L_04.pdf; Pins: 2; Length: 2 mm; Min Operating Temperature: -55 degC; Height: 0.5 mm; Mounting Technology: Surface Mount; RoHSCompliant: true; REACH SVHC: No SVHC; ComponentLink1URL: http://www.yageo.com/; Max Operating Temperature: 155 degC; PackageReference: 0805; DatasheetVersion: Rev. 4, 02/2016; Package Quantity: 5000; Packaging: Tape and Reel; ComponentLink2Description: Datasheet; PackageDescription: 2-Pin Surface Mounted Device, Body 2 x 1.25 mm
R12 R15 = CMP-2001-03932-1: Manufacturer: Vishay Dale; Part Number: CRCW0805470RFKEA
R13 = CMP-07231-004348-1: Thick Film Chip Resistors 0805 0Ω 0.125W 5%; Voltage Rating: 150V; Max Power Dissipation: 125mW; Temperature Coefficient: 500ppm/°C; Min Operating Temperature: -55°C; Case Code (Metric): 2012; Height: 0.5mm; Contact Plating: Tin; Thickness: 508um; Military Standard: Not; Composition: Thick Film; REACH SVHC: No SVHC; Voltage Rating (DC): 150V; Length: 2mm; Radiation Hardening: No; Case/Package: 0805; Package Quantity: 5000; Number of Pins: 2; Max Operating Temperature: 155°C; Case Code (Imperial): 0805; Mount: Surface Mount; Depth: 1.25mm; Packaging: Tape and Reel; Tolerance: 5%; Termination: SMD/SMT; Width: 1.25mm; Power Rating: 125mW
SW3 SW4 = CMP-05618-000006-1: SWITCH TACTILE SPST-NO 0.02A 15V; Manufacturer: Panasonic Electronic Components; Operating Force: 2.6N; Contact Resistance: 50mΩ; Contact Current Rating: 20mA; Electromechanical Life: 200000Cycles; Throw Configuration: SPST-NO; Automotive: No; Digikey Description: SWITCH TACTILE SPST-NO 0.02A 15V; Device Class L3: Tactile Switches; Device Class L2: Switches; Temperature Range Low: -20°C; ComponentLink2Description: Datasheet; RoHS: TRUE; Mount: Surface Mount; Package: 0; Height: 1.7mm; Octopart: https://octopart.com/evq-plma15-panasonic-39850235; Temperature Range High: +70°C; Device Class L1: Electromechanical; Category: Switch; Mouser Description: Tactile Switches FLAT ACT 2.6NF 4.6x3.4x1.5mm; Voltage Rating Dc: 15V; Manufacturer Part Number: EVQ-PLMA15; ComponentLink2URL: https://datasheet.ciiva.com/8164/atv0000ce2-8164994.pdf; Lead Free: Yes; Temperature: -20°C to +70°C
U5 = CMP-0005-00011-1: SPI Serial Flash Memory, 32 Megabit, 100 MHz, 2.7 to 3.6 V, -40 to 85 degC, 8-Pin SOIC (S2-8), RoHS, Tape and Reel; Manufacturer: Adesto; Max. Freq: 100 MHz; DatasheetVersion: Rev. 3686E; Interface: Serial; Packing: Tape and Reel; Mounting Technology: Surface Mount; Device Density: 32 Megabit; PackageDescription: 8-Pin Plastic Gull Wing Small Outline Package, Body 5.24 x 5.29 mm, Pitch 1.27 mm; PackageReference: S2-8; ComponentLink3URL: http://www.adestotech.com/sites/default/files/datasheets/doc3668.pdf; ComponentLink1Description: Manufacturer URL; Operating Voltage: 2.7 to 3.6 V; ComponentLink2Description: Datasheet; Operating Temperature: -40 to 85 degC; PackageVersion: Rev. F; ComponentLink3Description: Package Specification; ComponentLink1URL: http://www.adestotech.com/; RoHS: TRUE; PartNumber: AT25DF321A-SH-T; ComponentLink2URL: http://www.adestotech.com/sites/default/files/datasheets/doc3686.pdf
U7 = CMP-2000-07453-1: Low-Power, Highly-Integrated Wi-Fi Solution, 2.5 to 3.6 V, 80 mA, -40 to 125 degC, 32-Pin QFN; Manufacturer: Espressif Systems; Mounting Technology: SurfaceMount; Datasheet URL: http://espressif.com/sites/default/files/documentation/0a-esp8266ex_datasheet_en.pdf; Package Reference: QFN-32; Package Description: 32-Pin Quad Falt No-Lead, Body 5 x 5 mm, Pitch 0.5 mm; Manufacturer URL: http://espressif.com; Datasheet Version: Rev. 5.4, 04/2017
Y3 = CMP-27762-004449-1: Crystal 26MHz ±10ppm 10pF SMD-4 3.2mm x 2.5mm; Capacitance: 1E-11F; Operating Frequency: 26 MHz; Lead Free: Lead Free; Frequency: 26MHz; Min Operating Temperature: -40°C; Max Operating Temperature: 85°C; Frequency Tolerance: 10ppm; Load Capacitance: 10pF

## Sheet Sensor_interfacing.SchDoc
size A4; SheetNumber: 6; SheetTotal: 6
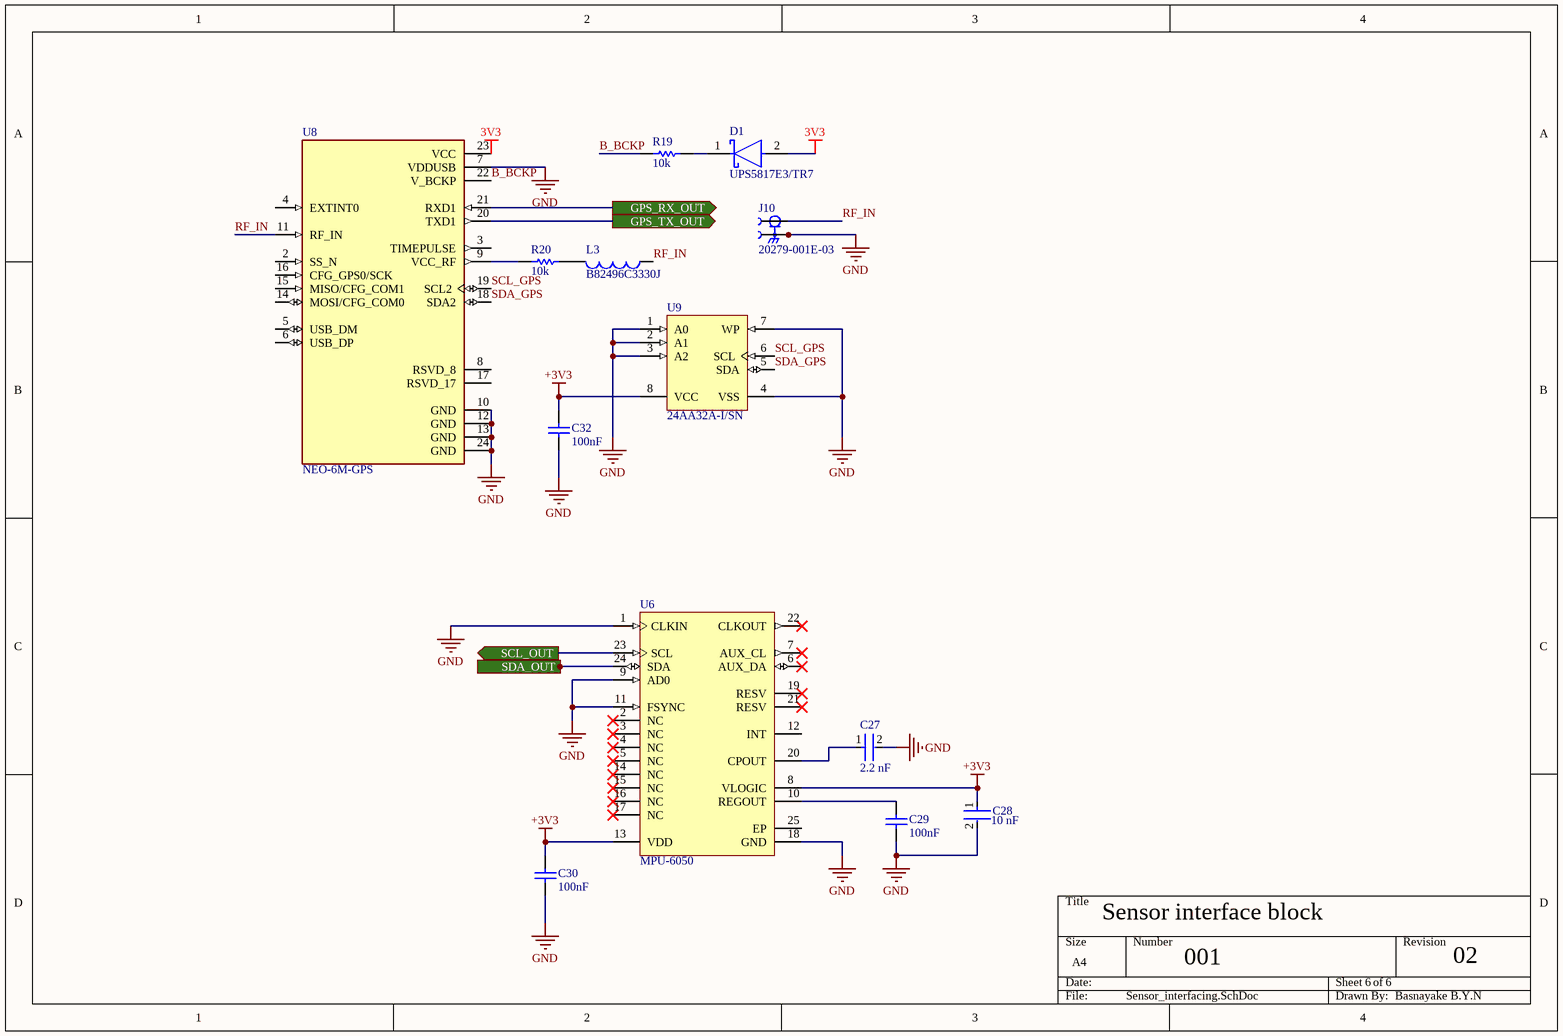
[diagram p4: Sensor_interfacing.SchDoc]

### Parts
C27  Capacitance: 2.2 nF  [FP-CC0402-MFG]  (hidden comment: CC0402KRX7R9BB222)
C28  Capacitance: 10 nF  [FP-CC0402-MFG]  (hidden comment: CC0402KRX7R9BB103)
C29  Capacitance: 100nF  [CAPC1050X55X23ML05T13]  (hidden comment: CL05B104KO5NNNC)
C30  Capacitance: 100nF  [CAPC1050X55X23ML05T13]  (hidden comment: CL05B104KO5NNNC)
C32  Capacitance: 100nF  [CAPC1050X55X23ML05T13]  (hidden comment: CL05B104KO5NNNC)
D1  UPS5817E3/TR7  [FP-DO-216AA-MFG]
J10  20279-001E-03  [IPEX_20279-001E-03]
L3  B82496C3330J  [INDC1608X90X30LL10T20]
R19  Parameter 1: 10k  [RESC2013X60X35NL10T20]  (hidden comment: RC0805FR-0710KL)
R20  Parameter 1: 10k  [RESC2013X60X35NL10T20]  (hidden comment: RC0805FR-0710KL)
U6  MPU-6050  [IS-QFN-24_V]
U8  NEO-6M-GPS  [XCVR_NEO-6M-GPS]
U9  24AA32A-I/SN  [SOIC-SN8_L]

### Ports
GPS_RX_OUT (out, see Top_domain[2B]), GPS_TX_OUT (out, see Top_domain[2B]), SCL_OUT (out, see Top_domain[2B]), SDA_OUT (out, see Top_domain[2B])

### Nets
3V3: D1.2(A) U8.23(VCC)
+3V3: C28.1 C30.2 C32.2 U6.8(VLOGIC) U6.13(VDD) U9.8(VCC)
GND: C27.2 C28.2 C29.1 C30.1 C32.1 J10.2(GROUND) J10.3(GROUND) U6.1(CLKIN) U6.9(AD0) U6.11(FSYNC) U6.18(GND) U8.7(VDDUSB) U8.10(GND) U8.12(GND) U8.13(GND) U8.24(GND) U9.1(A0) U9.2(A1) U9.3(A2) U9.4(VSS) U9.7(WP)
6P: U8.21(RXD1) ; port GPS_RX_OUT
7P: U8.20(TXD1) ; port GPS_TX_OUT
B_BCKP: R19.1 U8.22(V_BCKP)
RF_IN: J10.1(SIGNAL) L3.1 U8.11(RF_IN)
SCL: U6.23(SCL) ; port SCL_OUT
SCL_GPS: U8.19(SCL2) U9.6(SCL)
SDA: U6.24(SDA) ; port SDA_OUT
SDA_GPS: U8.18(SDA2) U9.5(SDA)
NetC27_1: C27.1 U6.20(CPOUT)
NetC29_2: C29.2 U6.10(REGOUT)
NetD1_1: D1.1(C) R19.2
NetL3_2: L3.2 R20.2
NetR20_1: R20.1 U8.9(VCC_RF)

Not connected (* = marked no-connect by the designer): U6 2(NC)* 3(NC)* 4(NC)* 5(NC)* 6(AUX_DA)* 7(AUX_CL)* 12(INT) 14(NC)* 15(NC)* 16(NC)* 17(NC)* 19(RESV)* 21(RESV)* 22(CLKOUT)* 25(EP); U8 2(SS_N) 3(TIMEPULSE) 4(EXTINT0) 5(USB_DM) 6(USB_DP) 8(RSVD_8) 14(MOSI/CFG_COM0) 15(MISO/CFG_COM1) 16(CFG_GPS0/SCK) 17(RSVD_17)

### Notes on the sheet
- Sensor interface block
- 001
- 6
- 02
- Basnayake B.Y.N

### Library data of the parts
C27 = CMP-1034-01742-2: CAP CER 2200PF 50V X7R 0402; Manufacturer: YAGEO; Material: Ceramic; Automotive Grade: NA; Temperature Coefficient: 30ppm/°C; Tolerance: 0.1; Value: 2.2 nF; Footprint Url: http://www.yageo.com/exep/pages/download/literatures/UPY-C_GEN_24.pdf; Temperature: -55°C to +125°C; RoHS: TRUE; Mouser Description: Multilayer Ceramic Capacitors MLCC - SMD/SMT 2.2nF 50V X7R 10%; Temperature Range Low: -55°C; ComponentLink2URL: http://www.yageo.com/documents/recent/UPY-GP_NP0_16V-to-50V_16.pdf; Digikey Description: CAP CER 2200PF 50V X7R 0402; Manufacturer Part Number: CC0402KRX7R9BB222; Device Class L3: Ceramic Capacitors; Lead Free: Yes; Octopart: https://octopart.com/cc0402krx7r9bb222-yageo-39467642; Package: CC0402; ComponentLink2Description: Datasheet; Category: Cap; Device Class L1: Passive Components; Height: 0.55mm; Temperature Characteristic: X7R; Device Class L2: Capacitors; Voltage Rating: 50 V; Ipc Land Pattern Name: CAPC10050X50; Temperature Range High: +125°C; Automotive: No
C28 = CMP-2100-03592-2: CAP CER 10000PF 50V X7R 0402; Manufacturer: YAGEO; Temperature Coefficient: 30ppm/°C; Material: Ceramic; Automotive Grade: NA; Tolerance: 0.1; Value: 10 nF; Device Class L3: Ceramic Capacitors; Temperature: -55°C to +125°C; Footprint Url: http://www.yageo.com/exep/pages/download/literatures/UPY-C_GEN_24.pdf; Ipc Land Pattern Name: CAPC10050X50; Device Class L1: Passive Components; Automotive: No; Octopart: https://octopart.com/cc0402krx7r9bb103-yageo-8376513; Manufacturer Part Number: CC0402KRX7R9BB103; Lead Free: Yes; Temperature Range Low: -55°C; Height: 0.55mm; ComponentLink2URL: http://www.yageo.com/documents/recent/UPY-GP_NP0_16V-to-50V_16.pdf; Category: Cap; ComponentLink2Description: Datasheet; Temperature Range High: +125°C; Digikey Description: CAP CER 10000PF 50V X7R 0402; Voltage Rating: 50 V; Package: CC0402; Device Class L2: Capacitors; Mouser Description: 0402 10 nF 50 V ±10 % Tolerance X7R SMT Multilayer Ceramic Capacitor; RoHS: TRUE; Temperature Characteristic: X7R
C29 C30 C32 = CMP-2000-05439-1: Chip Capacitor, 100 nF, +/- 10%, 16 V, -55 to 125 degC, 0402 (1005 Metric), RoHS, Tape and Reel; Manufacturer: Samsung Electro-Mechanics; Dielectric: X7R; Rated Voltage: 16V; Case Size/Dimension: 0402; Tolerance (%): ±10%; Manufacturer URL: http://www.samsungsem.com/global/index.jsp; Datasheet URL: https://datasheet.ciiva.com/29198/458718-da-01-en-vs-kondensator-0402-29198423.pdf; Datasheet Version: Nov-10
D1 = CMP-00252-99195103-1: UPS5817E3/TR7 Rectifier Diode, Schottky, 1 Phase, 1 Element, 1A, 20V V(RRM), Silicon, DO-216AA; Capacitance: 105pF; Element Configuration: Single; Polarity: Standard; Forward Voltage: 450mV; Peak Non-Repetitive Surge Current: 50A; Peak Reverse Current: 1mA; NexarPartId: 99195103; Average Rectified Current: 1A; Min Operating Temperature: -55°C; Forward Current: 1A; Reverse Voltage (DC): 20V; Height: 1.14mm; Lead Free: Lead Free; Width: 2.03mm; Schedule B: 8541100080, 8541100080; Length: 2.03mm; Lifecycle Status: Production; Output Current: 1A; Packaging: Tape & Reel (TR); Voltage Rating (DC): 20V; RoHS: Compliant; Number of Pins: 1; Max Forward Surge Current (Ifsm): 50A; Max Repetitive Reverse Voltage (Vrrm): 20V; Mount: Surface Mount; Max Reverse Voltage (DC): 20V; Max Operating Temperature: 150°C; Radiation Hardening: No; Current Rating: 1A
J10 = 20279-001E-03: as J11 on sheet asynchronous; SnapEDA_Link: https://www.snapeda.com/parts/20279-001E-03/I-PEX/view-part/?ref=snap; Package: None; Value: *; MP: 20279-001E-03; Check_prices: https://www.snapeda.com/parts/20279-001E-03/I-PEX/view-part/?ref=eda
L3 = CMP-2000-05913-1: as L1 on sheet asynchronous; Manufacturer URL: http://www.tdk.com/; Type: Wirewound; Mounting Type: SurfaceMount; Mounting Technology: SurfaceMount; Height - Seated (Max): 0.035"(0.90mm); Datasheet URL: https://en.tdk.eu/inf/30/db/ind_2008/b82496c.pdf; Shielding: Unshielded; Operating Temperature: -; Size / Dimension: 0.063"Lx0.031"W(1.60mmx0.80mm); Series: SIMID; Current - Saturation: -; Ratings: AEC-Q200; Packaging: CutTape(CT); Package Reference: 0603; Datasheet Version: 07/2016; Category: Inductors,Coils,Chokes; Package Description: 2-Pin Surface Mount Device, Body 1.6 x 0.8 mm; Family: FixedInductors; Package / Case: 0603(1608Metric)
R19 R20 = CMP-1659-00013-4: as R11 on sheet asynchronous; Mount: Surface Mount; ComponentLink1Description: Manufacturer URL; ComponentLink2URL: http://www.yageo.com/documents/recent/PYu-RC_Group_51_RoHS_L_04.pdf; Pins: 2; Length: 2 mm; Min Operating Temperature: -55 degC; Height: 0.5 mm; Mounting Technology: Surface Mount; RoHSCompliant: true; REACH SVHC: No SVHC; ComponentLink1URL: http://www.yageo.com/; Max Operating Temperature: 155 degC; PackageReference: 0805; DatasheetVersion: Rev. 4, 02/2016; Package Quantity: 5000; Packaging: Tape and Reel; ComponentLink2Description: Datasheet; PackageDescription: 2-Pin Surface Mounted Device, Body 2 x 1.25 mm
U6 = CMP-1753-00002-2: 3-Axis Gyroscope, Accelerometer and a Digital Motion Processor(TM) (DMP), 2.375 to 3.46 V, -40 to 85 degC, 24-Pin QFN, RoHS, Tape and Reel; Manufacturer: InvenSense; Featured Product: MPU-60506-Axis,IntegratedI²CSolution; Other Names: 1428-1007-2 / MPU6050; Sensor Type: MotionTracking; Online Catalog: MPU-6000™Series; Unit PriceUSD: Digital; Datasheet Version: Rev. 3.3, 05/2012; Category: Sensors,Transducers; Datasheet URL: http://datasheet.octopart.com/MPU-6050-InvenSense-datasheet-14421344.pdf; Family: Multifunction; Standard Package: 5,000; Manufacturer URL: http://www.invensense.com/; Output Type: Digital; Dynamic Catalog: MPU-6000™Series
U8 = CMP-006-000000-1: GPS Development Tools SparkFun GNSS-RTK Dead Reckoning Breakout - ZED-F9K (Qwiic); MF: u-blox; Price: None; Source: NEO-6M-GPS.SchLib; Availability: Not in stock; MP: NEO-6M-GPS; Component Type: Standard; Check_prices: https://www.snapeda.com/parts/NEO-6M-GPS/u-blox/view-part/?ref=eda; Value: *; Design Item ID: NEO-6M-GPS; Pin Count: 23; Package: None; SnapEDA_Link: https://www.snapeda.com/parts/NEO-6M-GPS/u-blox/view-part/?ref=snap
U9 = CMP-0159-00205-1: 32Kbit, 400kHz, 1.7V, I2C Serial EEPROM, 8-Pin SOIC 150mil, Industrial Temperature; Code_JEDEC: MS-012; PackageVersion: revBB, Aug-2009; PackageReference: SOIC-SN8; PackageDescription: 8-Lead Plastic Small Outline (SN) - Narrow, 3.90mm Body [SOIC]; Code_IPC: SOIC127P600-8; DatasheetVersion: revJ, Feb-2009

## Sheet Stepper_control.SchDoc
size A4; SheetNumber: 2; SheetTotal: 6
Used 2 times, as channels Stepper_AZ, Stepper_Alt. Parts and nets are listed once, with the designators drawn on the sheet.
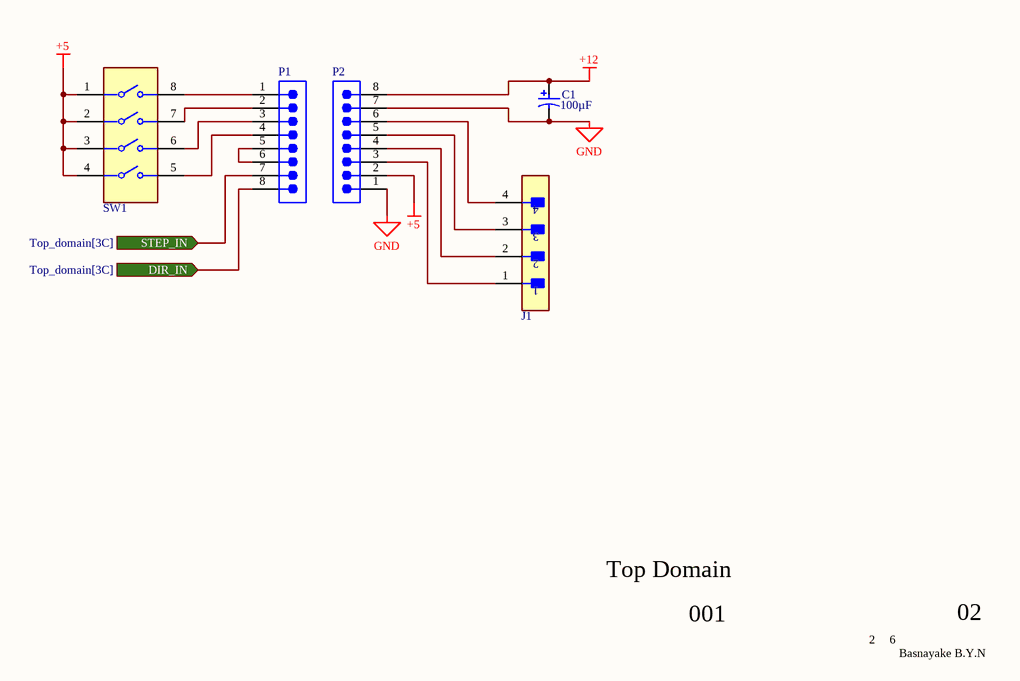
[diagram p5: Stepper_control.SchDoc]

### Parts
C1  Capacitance: 100µF  [PNSC-FK-V-D8_V]  (hidden comment: EEEFK1E101XP)
J1  B4B-XH-A(LF)(SN)  [FP-B4B-XH-A_LF_SN-MFG]  (value not drawn)
P1  61300811121  [61300811121]  (value not drawn)
P2  61300811121  [61300811121]  (value not drawn)
SW1  1825360-3  [FP-1825360-3-MFG]  (value not drawn)

### Ports
DIR_IN (in, see Top_domain[3C]), STEP_IN (in, see Top_domain[3C])

### Nets
+5: P2.2 SW1.1 SW1.2 SW1.3 SW1.4
+12: C1.1 P2.8
GND: C1.2 P2.1 P2.7
DIR_IN: P1.8 ; port DIR_IN
STEP_IN: P1.7 ; port STEP_IN
NetJ1_1: J1.1 P2.3
NetJ1_2: J1.2 P2.4
NetJ1_3: J1.3 P2.5
NetJ1_4: J1.4 P2.6
NetP1_1: P1.1 SW1.8
NetP1_2: P1.2 SW1.7
NetP1_3: P1.3 SW1.6
NetP1_4: P1.4 SW1.5
NetP1_5: P1.5 P1.6

### Channels
Stepper_AZ: designators end in A; ports DIR_IN=46P STEP_IN=48P
Stepper_Alt: designators end in B; ports DIR_IN=45P STEP_IN=47P

### Notes on the sheet
- Top Domain
- 001
- 2
- 6
- 02
- Basnayake B.Y.N

### Library data of the parts
C1 = CMP-2000-06206-1: Aluminum Electrolytic Capacitor, 100 uF, +/- 20%, 25 V, 2-Pin SMD (Size Code D8), -55 to 105 degC, RoHS, Tape and Reel; Manufacturer: Panasonic; Type: Can; Lifetime@Temperature: 2000Hrs@105°C; Rated Voltage: 25V; Ripple Current: 280mA; Impedance: 0.34O; Case Size/Dimension: Ø6.3x7.7mm; Operating Temp-Max: 105°C; Series: FK; Package URL: http://industrial.panasonic.com/cdbs/www-data/pdf/RDE0000/DME0000COL48.pdf; Mounting Technology: SurfaceMount; Package Description: 2-Pin Electrolytic Aluminum Capacitor, Body 6.6 x 6.6 mm; Datasheet Version: 03/2016; Datasheet URL: http://industrial.panasonic.com/cdbs/www-data/pdf/RDE0000/ABA0000C1181.pdf; Manufacturer URL: http://www.panasonic.com/; Package Reference: FK-V-D8; Operating Temp Range: -55to+105°C
J1 = CMP-17439-000250-1: CONN HEADER VERT 4POS 2.5MM; Number of Contacts: 4; Contact Resistance: 20mR; Voltage Rating: 250V; Max Current Rating: 3A; Gender: Male; Wire/Cable Gauge: 22AWG; Mated Stacking Heights: 9.8mm; Insulation Resistance: 1GR; Orientation: Straight; Contact Type: Male Pin; Contact Finish - Mating: TIN; Series: XH; Max Voltage Rating (AC): 250V; Lead Pitch: 2.5mm; Contact Shape: Square; Insulation Color: Natural; Termination: Solder; Lead Free: Lead Free; Voltage Rating (AC): 250V; Number of Rows: 1; Flammability Rating: UL94 V-0; Number of Positions: 4; Max Operating Temperature: 85°C; Package Quantity: 500; Mount: Through Hole; REACH SVHC: No SVHC; Connector Type: Header; Insulation Material: Nylon; Fastening Type: Detent; Min Operating Temperature: -25°C; Housing Color: White; Packaging: Bulk; Contact Plating: Tin; Contact Material: Brass; Max Voltage Rating (DC): 250V; Housing Material: Polyamide; Color: Natural; Material: Polyamide; Pitch: 2.5mm; Depth: 5.75mm; Current Rating: 3A; Length: 12.4mm
P1 P2 = CMP-1502-01076-2: NexarPartId: 32855533; Current Rating: 3A; Connector Type: Male Pin; Voltage Rating: 250V; Number of Contacts: 8; Pitch: 2.54mm; Contact Resistance: 20mΩ; Gender: Male; REACH SVHC: Unknown; Number of Rows: 1; Mount: Through Hole; Termination: Solder; Number of Pins: 8; Number of Positions: 8; Height: 8.54mm; Contact Mating Length: 5.9944mm; Orientation: Vertical; Operating Supply Voltage: 250V; Min Operating Temperature: -40°C; Max Operating Temperature: 105°C; Packaging: Bulk; Color: Black; Lead Pitch: 2.54mm; RoHS: Compliant; Contact Material: Copper; Contact Plating: Gold
SW1 = CMP-03400-000022-1: SWITCH SLIDE DIP SPST 100MA 24V; Washable: Yes; Contact Current Rating: 1A; Electrical Life: 1000Cycles; Number of Circuits: 4; Pitch: 0.1inch; Actuator Length: 0.99mm; Contact Resistance: 50mR; Actuator Type: Standard; Contact Post Length: 4mm; Voltage Rating (DC): 5V; Actuator Material: Polybutylene; Sealable: No (Without); Max Voltage Rating (DC): 24V; Throw Configuration: SPST; Mount: Through Hole; Type: Switch; RoHS Compliant: Yes; Min Operating Temperature: -30°C; Max Operating Temperature: 85°C; Orientation: Straight; Packaging: Rail/Tube; Series: ADE; Lead Free: Lead Free; Depth: 7.49mm; Flammability Rating: UL94 V-0; Radiation Hardening: No; Terminal Pitch: 2.54mm; Package Quantity: 35; Contact Material: Copper Alloy; Housing Color: Black; Number of Positions: 4; Length: 0.476inch; ELV: Compliant; Termination: PC Pins; Housing Material: Polyphenylene; Contact Plating: Gold; Max Current Rating: 100mA; Height: 0.138inch

## Nets that join several sheets
3V3: Power (C20.1 C21.2 U4.2 U4.4), asynchronous (14 pins), Sensor_interfacing (D1.2 U8.23)
+5: Power (5 pins), synchronous (J3.5), Stepper_AZ (5 pins), Stepper_Alt (5 pins)
+5V: Power (C12.1 LED2.1 LED3.1 U2.16), synchronous (11 pins)
+12: Power (C13.1 C14.2 J5.1 U3.3), Stepper_AZ (C1A.1 P2A.8), Stepper_Alt (C1B.1 P2B.8)
GND: Power (26 pins), synchronous (21 pins), asynchronous (24 pins), Sensor_interfacing (21 pins), Stepper_AZ (C1A.2 P2A.1 P2A.7), Stepper_Alt (C1B.2 P2B.1 P2B.7)
0P: synchronous (U1.2), asynchronous (R14.1)
1P: synchronous (U1.3), asynchronous (R13.1)
6P: synchronous (U1.15), Sensor_interfacing (U8.21)
7P: synchronous (U1.16), Sensor_interfacing (U8.20)
45P: synchronous (U1.39), Stepper_Alt (P1B.8)
46P: synchronous (U1.38), Stepper_AZ (P1A.8)
47P: synchronous (U1.37), Stepper_Alt (P1B.7)
48P: synchronous (U1.36), Stepper_AZ (P1A.7)
NetU1_4: synchronous (U1.4), asynchronous (U7.16)
SCL: synchronous (R2.2 U1.43), Sensor_interfacing (U6.23)
SDA: synchronous (R3.2 U1.44), Sensor_interfacing (U6.24)